# EAGLE design HandHeld_O2_Analyzer (EAGLE 9.4.2)
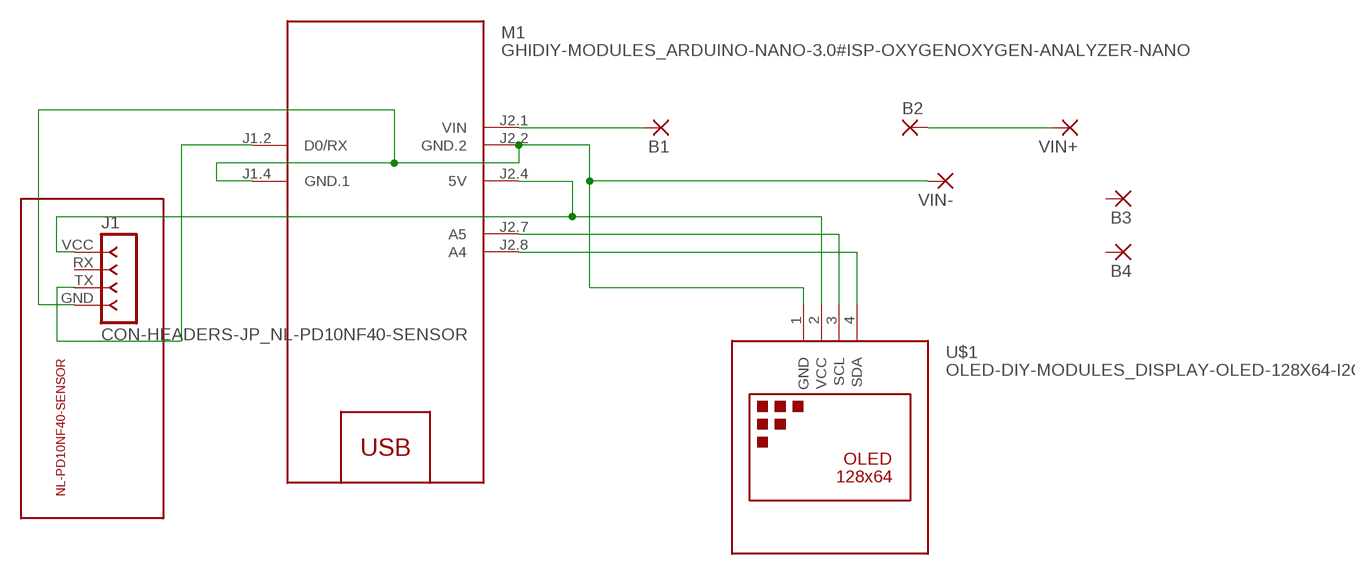
[diagram p0: schematic, sheet 1]

## Parts
B1  2,54/0,8  [2,54/0,8]
B2  2,54/0,8  [2,54/0,8]
B3  2,54/0,8  [2,54/0,8]
B4  2,54/0,8  [2,54/0,8]
J1  CON-HEADERS-JP_NL-PD10NF40-SENSOR  [CON-HEADERS-JP_NL-PD10NF40-SENSOR]
M1  GHIDIY-MODULES_ARDUINO-NANO-3.0#ISP-OXYGENOXYGEN-ANALYZER-NANO  [GHIDIY-MODULES_ARDUINO-NANO-3.0#ISP-OXYGEN]
U$1  OLED-DIY-MODULES_DISPLAY-OLED-128X64-I2C  [OLED-DIY-MODULES_DISPLAY-OLED-128X64-I2C]
VIN+  WIREPAD_2,54/0,8  [WIREPAD_2,54/0,8]
VIN-  WIREPAD_2,54/0,8  [WIREPAD_2,54/0,8]

## Nets
N$1: M1.J2.8(A4) U$1.4(SDA)
N$2: M1.J2.7(A5) U$1.3(SCL)
N$3: J1.GND M1.J1.4(GND.1) M1.J2.2(GND.2) U$1.1(GND) VIN-.1(P)
N$4: J1.VCC M1.J2.4(5V) U$1.2(VCC)
N$5: B1.1(P) M1.J2.1(VIN)
N$6: B2.1(P) VIN+.1(P)
N$8: J1.TX M1.J1.2(D0/RX)
Unconnected: B3.1(P) B4.1(P) J1.RX

## Library data of the parts
B1-B4 = wirepad:2,54/0,8: THROUGH-HOLE PAD
J1 = Oxygen Analyzer:CON-HEADERS-JP_NL-PD10NF40-SENSOR: FEMALE HEADER
M1 = Oxygen Analyzer:GHIDIY-MODULES_ARDUINO-NANO-3.0#ISP-OXYGEN*?: Arduino Nano 3.0 (and compatible devices) with ISP pads More details available here: https://www.arduino.cc/en/Main/ArduinoBoardNano Click here to find device on ebay.com <http://www.ebay.com/sch/arduino+nano>
U$1 = Oxygen Analyzer:OLED-DIY-MODULES_DISPLAY-OLED-128X64-I2C: 128x64 Dot Matrix OLED Module based on SSD1306 chip Variant with I2C interface More details available here: http://www.instructables.com/id/Monochrome-096-i2c-OLED-display-with-arduino-SSD13/ SSD1306 datasheet: https://cdn-shop.adafruit.com/datasheets/SSD1306.pdf Click here to find device on ebay.com <http://www.ebay.com/sch/oled+display+128x64+iic> Note: There are two variants: I2C and SPI. Search for the proper version.
VIN+ VIN- = Oxygen Analyzer:WIREPAD_2,54/0,8: THROUGH-HOLE PAD

## Net classes
0 default: width 1.27 mm, drill 1.27 mm, clearance 0.635 mm
1 Profile1: width 0.762 mm, drill 0.762 mm, clearance 0.635 mm

## Board
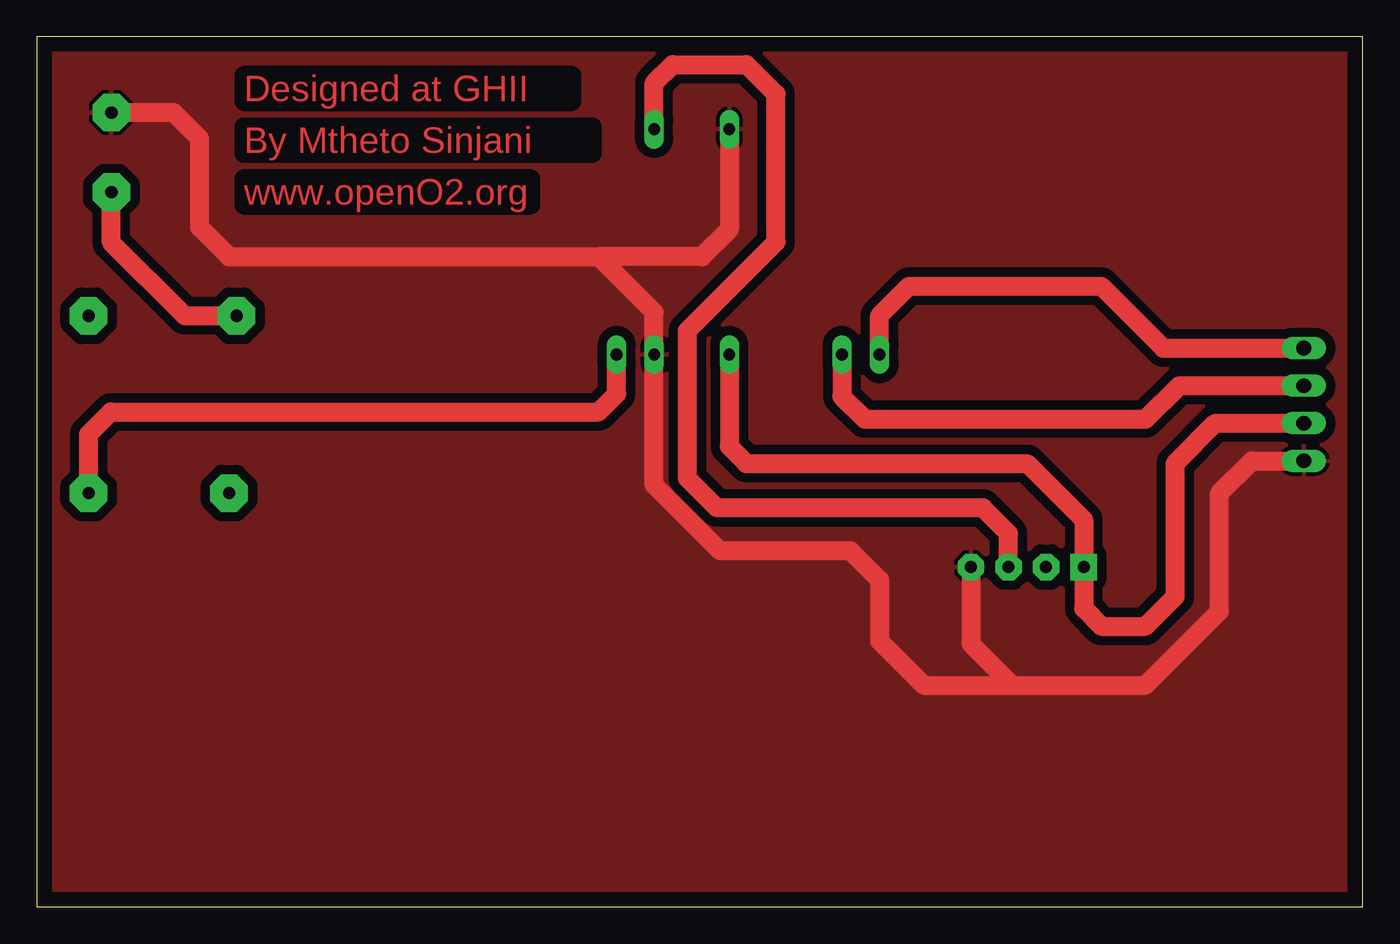
[diagram p1: board, top side]
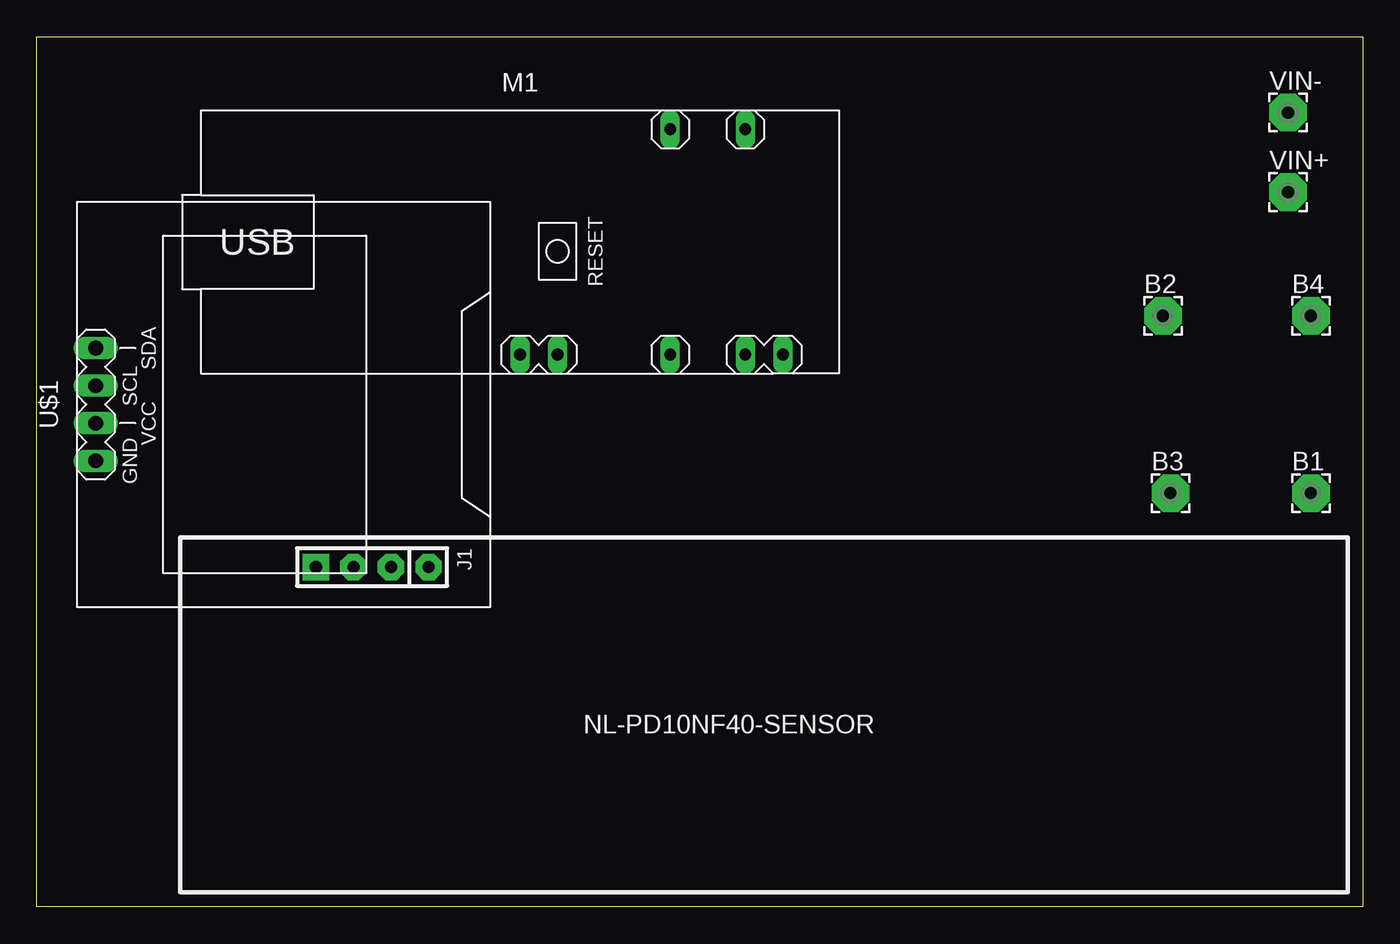
[diagram p2: board, bottom side, seen from below]

Size 89.68 x 58.87 mm. Coordinates in mm from the lower left corner, seen from the top.
Outline: 0,0 89.68,0 89.68,58.87 0,58.87 0,0
Copper layers (1*16): Top 0.035mm / dielectric 1.5mm / Bottom 0.035mm
Design rules "default": minimum track width 6mil, minimum drill 0.35mm, track to track 6mil, track to pad 6mil, pad to pad 6mil, via to via 6mil, smd to smd 6mil, copper to edge 40mil, drill to drill 6mil, minimum pad ring 10mil, minimum via ring 8mil, stop-mask expansion 4mil, vias tented up to drill 0mil, thermal gap 10mil

### Footprints (pad centres in the part's own frame; a part is rotated, then mirrored left to right if it is on the bottom)
2,54/0,8 = drill 0.813 pad 2.54 octagon: 1 0,0
CON-HEADERS-JP_NL-PD10NF40-SENSOR = drill 0.813 pad 1.778 octagon: GND 6.19,0; RX 11.27,0; TX 8.73,0 | drill 0.813 pad 1.778 square: VCC 13.81,0
GHIDIY-MODULES_ARDUINO-NANO-3.0#ISP-OXYGEN = drill 0.8 pad 1.016 long: J1.2 15.24,7.62; J1.4 10.16,7.62; J2.1 17.78,-7.62; J2.2 15.24,-7.62; J2.4 10.16,-7.62; J2.7 2.54,-7.62; J2.8 0,-7.62
OLED-DIY-MODULES_DISPLAY-OLED-128X64-I2C = drill 1 pad 1.27 long: 1 -3.81,12.7; 2 -1.27,12.7; 3 1.27,12.7; 4 3.81,12.7
WIREPAD_2,54/0,8 = drill 0.813 pad 2.54 octagon: 1 0,0

### Placement (x,y rotation side)
B1  3.5,28 0 bottom
B2  13.5,40 0 bottom
B3  13,28 0 bottom
B4  3.5,40 0 bottom
J1  57,23 180 bottom
M1  57,45 0 bottom
U$1  73,34 90 bottom
VIN+  5.04,48.37 0 bottom
VIN-  5.04,53.75 0 bottom

### Tracks (layer width: path | path; a pad name or v marks a point on that pad's centre or on a via)
N$1
  Top 1.27: M1.J2.8 57,40 59,42 72,42 76.19,37.81 U$1.4
N$2
  Top 1.27: M1.J2.7 54.46,34.54 56,33 75,33 77.27,35.27 U$1.3
N$3
  Top 1.27: 66,15 63.19,17.81 J1.GND | 66,15 75,15 80,20 80,28 82.19,30.19 U$1.1 | 66,15 60,15 57,18 57,22.14 55.05,24.09 46.21,24.09 41.76,28.55 M1.J2.2 41.76,40.24 38,44 | 38,44 13,44 11,46 11,52 9.25,53.75 VIN-.1 | M1.J1.4 46.84,45.84 45,44 38,44
  pour Top (isolate 0.325, rank 6): 0,59 90,59 90,0 0,0
N$4
  Top 1.27: M1.J2.4 46.84,31.16 48,30 67,30 70.81,26.19 J1.VCC 70.81,20.19 72,19 75,19 77,21 77,30 79.73,32.73 U$1.2
N$5
  Top 1.27: M1.J2.1 39.22,34.72 38,33.5 5,33.5 3.5,32 B1.1
N$6
  Top 1.27: B2.1 10,40 5.04,44.96 VIN+.1
N$8
  Top 1.27: M1.J1.2 41.76,55.76 43,57 48,57 50,55 50,45 44,39 44,29 46,27 64,27 65.73,25.27 J1.TX

### Text on the board
Top: Designed at GHII | By Mtheto Sinjani | www.openO2.org